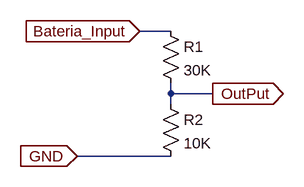
[diagram p0: schematic Dividor_Bateria.asc]
Dividor_Bateria.asc, the LTspice schematic file:
Version 4
SHEET 1 880 680
WIRE 80 80 32 80
WIRE 80 176 80 160
WIRE 144 176 80 176
WIRE 80 192 80 176
WIRE 80 272 -64 272
FLAG 32 80 Bateria_Input
IOPIN 32 80 In
FLAG -64 272 GND
IOPIN -64 272 In
FLAG 144 176 OutPut
IOPIN 144 176 Out
SYMBOL res 64 64 R0
SYMATTR InstName R1
SYMATTR Value 30K
SYMBOL res 64 176 R0
SYMATTR InstName R2
SYMATTR Value 10K

The netlist it stands for:
* Dividor_Bateria.asc
R1 Bateria_Input OutPut 30K
R2 OutPut GND 10K
.backanno
.end